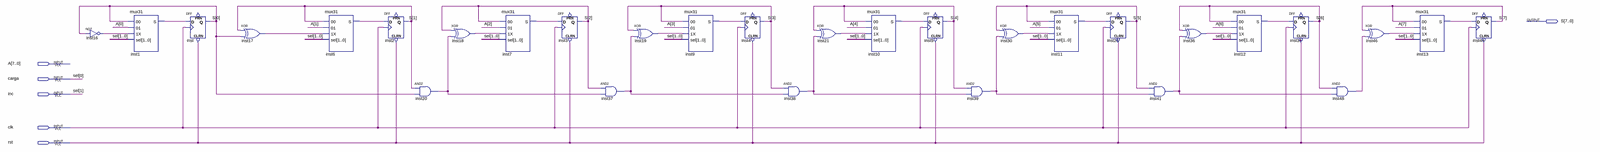
[diagram p0: schematic sheet, whole]
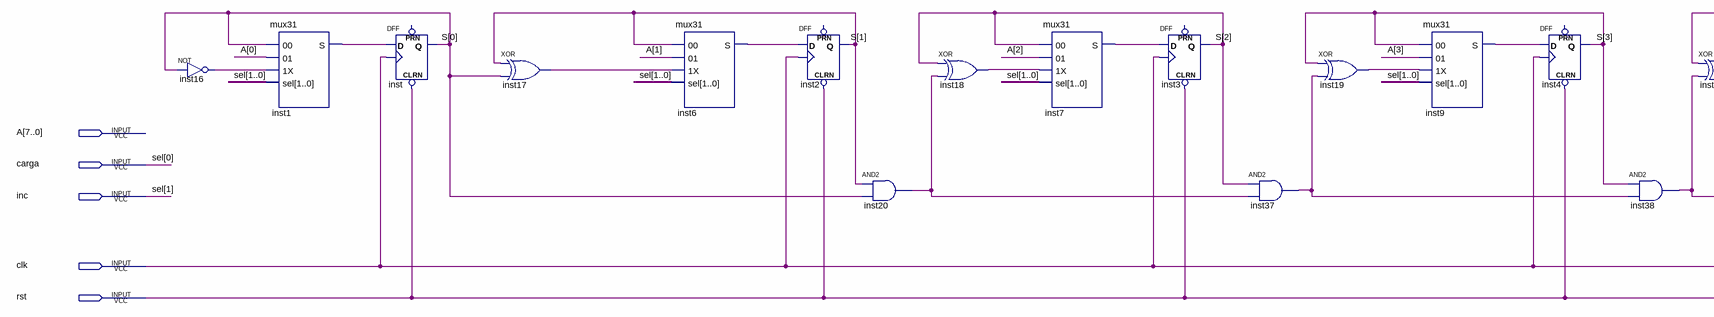
[diagram p1: schematic sheet, left part]
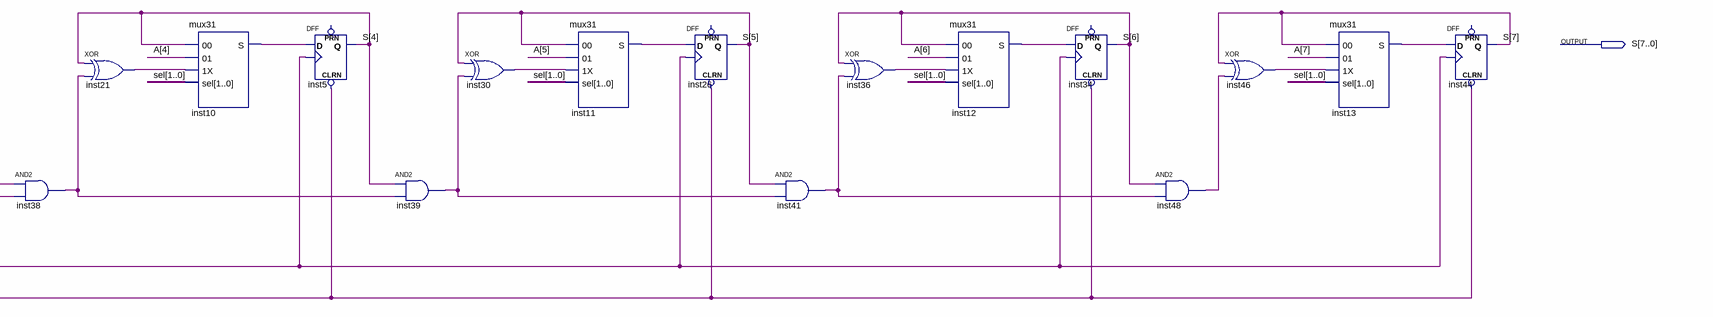
[diagram p2: schematic sheet, right part]
// Quartus schematic pc.bdf as structural Verilog: 30 symbols, 6 pins
module pc (
  input  [7:0] A,
  input  carga,
  input  inc,
  input  clk,
  input  rst,
  output [7:0] S
);

  wire inst1_s, inst6_s, inst7_s, inst9_s, inst10_s, inst11_s, inst12_s, inst13_s, inst16_out, inst17_out,
       inst18_out, inst19_out, inst20_out, inst21_out, inst30_out, inst36_out, inst37_out, inst38_out,
       inst39_out, inst41_out, inst46_out, inst48_out;

  not inst16 (inst16_out, S[0]);
  mux31 inst1 (.\00 (S[0]), .\01 (A[0]), .\1X (inst16_out), .sel({inc, carga}), .S(inst1_s));
  DFF inst (.CLRN(rst), .CLK(clk), .D(inst1_s), .Q(S[0]));  // open: PRN
  xor inst17 (inst17_out, S[1], S[0]);
  mux31 inst6 (.\00 (S[1]), .\01 (A[1]), .\1X (inst17_out), .sel({inc, carga}), .S(inst6_s));
  DFF inst2 (.CLRN(rst), .CLK(clk), .D(inst6_s), .Q(S[1]));  // open: PRN
  and inst20 (inst20_out, S[1], S[0]);
  xor inst18 (inst18_out, S[2], inst20_out);
  mux31 inst7 (.\00 (S[2]), .\01 (A[2]), .\1X (inst18_out), .sel({inc, carga}), .S(inst7_s));
  DFF inst3 (.CLRN(rst), .CLK(clk), .D(inst7_s), .Q(S[2]));  // open: PRN
  and inst37 (inst37_out, S[2], inst20_out);
  xor inst19 (inst19_out, S[3], inst37_out);
  mux31 inst9 (.\00 (S[3]), .\01 (A[3]), .\1X (inst19_out), .sel({inc, carga}), .S(inst9_s));
  DFF inst4 (.CLRN(rst), .CLK(clk), .D(inst9_s), .Q(S[3]));  // open: PRN
  and inst38 (inst38_out, S[3], inst37_out);
  xor inst21 (inst21_out, S[4], inst38_out);
  mux31 inst10 (.\00 (S[4]), .\01 (A[4]), .\1X (inst21_out), .sel({inc, carga}), .S(inst10_s));
  DFF inst5 (.CLRN(rst), .CLK(clk), .D(inst10_s), .Q(S[4]));  // open: PRN
  and inst39 (inst39_out, S[4], inst38_out);
  xor inst30 (inst30_out, S[5], inst39_out);
  mux31 inst11 (.\00 (S[5]), .\01 (A[5]), .\1X (inst30_out), .sel({inc, carga}), .S(inst11_s));
  DFF inst26 (.CLRN(rst), .CLK(clk), .D(inst11_s), .Q(S[5]));  // open: PRN
  and inst41 (inst41_out, S[5], inst39_out);
  xor inst36 (inst36_out, S[6], inst41_out);
  mux31 inst12 (.\00 (S[6]), .\01 (A[6]), .\1X (inst36_out), .sel({inc, carga}), .S(inst12_s));
  DFF inst34 (.CLRN(rst), .CLK(clk), .D(inst12_s), .Q(S[6]));  // open: PRN
  and inst48 (inst48_out, S[6], inst41_out);
  xor inst46 (inst46_out, S[7], inst48_out);
  mux31 inst13 (.\00 (S[7]), .\01 (A[7]), .\1X (inst46_out), .sel({inc, carga}), .S(inst13_s));
  DFF inst44 (.CLRN(rst), .CLK(clk), .D(inst13_s), .Q(S[7]));  // open: PRN

  // Other names for the same wires on the sheet: sel[1:0] = {inc, carga}
endmodule
